# EAGLE schematic Shield_Semaforo (EAGLE 9.5.1)
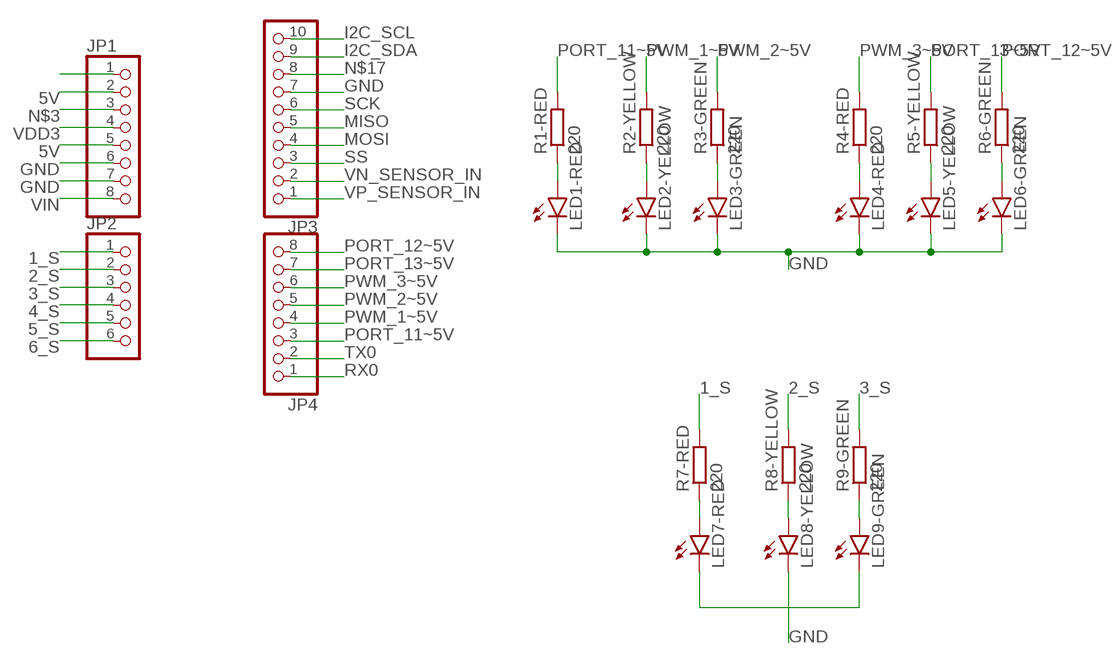
[diagram p0: schematic, sheet 1]

## Parts
JP1  PINHD-1X8_2.54-SMD  [1X08SMD]
JP2  PINHD-1X6_2.54-SMD  [1X06SMD]
JP3  PINHD-1X10_2.54-SMD  [1X10SMD]
JP4  PINHD-1X8_2.54-SMD  [1X08SMD]
LED1-RED  LED5MM  [LED5MM]
LED2-YELLOW  LED5MM  [LED5MM]
LED3-GREEN  LED5MM  [LED5MM]
LED4-RED  LED5MM  [LED5MM]
LED5-YELLOW  LED5MM  [LED5MM]
LED6-GREEN  LED5MM  [LED5MM]
LED7-RED  LED5MM  [LED5MM]
LED8-YELLOW  LED5MM  [LED5MM]
LED9-GREEN  LED5MM  [LED5MM]
R1-RED  220  R-EU_M0805  [M0805]
R2-YELLOW  220  R-EU_M0805  [M0805]
R3-GREEN  220  R-EU_M0805  [M0805]
R4-RED  220  R-EU_M0805  [M0805]
R5-YELLOW  220  R-EU_M0805  [M0805]
R6-GREEN  220  R-EU_M0805  [M0805]
R7-RED  220  R-EU_M0805  [M0805]
R8-YELLOW  220  R-EU_M0805  [M0805]
R9-GREEN  220  R-EU_M0805  [M0805]

## Nets
1_S: JP2.1 R7-RED.2
2_S: JP2.2 R8-YELLOW.2
3_S: JP2.3 R9-GREEN.2
4_S: JP2.4
5_S: JP2.5
5V: JP1.2 JP1.5
6_S: JP2.6
GND: JP1.6 JP1.7 JP3.7 LED1-RED.K(C) LED2-YELLOW.K(C) LED3-GREEN.K(C) LED4-RED.K(C) LED5-YELLOW.K(C) LED6-GREEN.K(C) LED8-YELLOW.K(C)
I2C_SCL: JP3.10
I2C_SDA: JP3.9
MISO: JP3.5
MOSI: JP3.4
N$1: JP1.1
N$2: LED1-RED.A R1-RED.1
N$3: JP1.3
N$4: LED2-YELLOW.A R2-YELLOW.1
N$5: LED3-GREEN.A R3-GREEN.1
N$6: LED4-RED.A R4-RED.1
N$7: LED5-YELLOW.A R5-YELLOW.1
N$8: LED6-GREEN.A R6-GREEN.1
N$16: LED7-RED.A R7-RED.1
N$17: JP3.8
N$18: LED8-YELLOW.A R8-YELLOW.1
N$19: LED9-GREEN.A R9-GREEN.1
N$23: LED7-RED.K(C) LED9-GREEN.K(C)
PORT_11~5V: JP4.3 R1-RED.2
PORT_12~5V: JP4.8 R6-GREEN.2
PORT_13~5V: JP4.7 R5-YELLOW.2
PWM_1~5V: JP4.4 R2-YELLOW.2
PWM_2~5V: JP4.5 R3-GREEN.2
PWM_3~5V: JP4.6 R4-RED.2
RX0: JP4.1
SCK: JP3.6
SS: JP3.3
TX0: JP4.2
VDD3: JP1.4
VIN: JP1.8
VN_SENSOR_IN: JP3.2
VP_SENSOR_IN: JP3.1

## Library data of the parts
JP1 JP4 = pinhead-1:PINHD-1X8: PIN HEADER
JP2 = pinhead-1:PINHD-1X6: PIN HEADER
JP3 = pinhead-1:PINHD-1X10: PIN HEADER
LED1-RED LED2-YELLOW LED3-GREEN LED4-RED LED5-YELLOW LED6-GREEN LED7-RED LED8-YELLOW LED9-GREEN = led:LED: LED OSRAM: - CHIPLED LG R971, LG N971, LY N971, LG Q971, LY Q971, LO R971, LY R971 LH N974, LH R974 LS Q976, LO Q976, LY Q976 LO Q996 - Hyper CHIPLED LW Q18S LB Q993, LB Q99A, LB R99A - SideLED LS A670, LO A670, LY A670, LG A670, LP A670 LB A673, LV A673, LT A673, LW A673 LH A674 LY A675 LS A676, LA A676, LO A676, LY A676, LW A676 LS A679, LY A679, LG A679 - Hyper Micro SIDELED® LS Y876, LA Y876, LO Y876, LY Y876 LT Y87S - SmartLED LW L88C, LW L88S LB L89C, LB L89S, LG L890 LS L89K, LO L89K, LY L89K LS L896, LA L896, LO L896, LY L896 - TOPLED LS T670, LO T670, LY T670, LG T670, LP T670 LSG T670, LSP T670, LSY T670, LOP T670, LYG T670 LG T671, LOG T671, LSG T671 LB T673, LV T673, LT T673, LW T673 LH T674 LS T676, LA T676, LO T676, LY T676, LB T676, LH T676, LSB T676, LW T676 LB T67C, LV T67C, LT T67C, LS T67K, LO T67K, LY T67K, LW E67C LS E67B, LA E67B, LO E67B, LY E67B, LB E67C, LV E67C, LT E67C LW T67C LS T679, LY T679, LG T679 LS T770, LO T770, LY T770, LG T770, LP T770 LB T773, LV T773, LT T773, LW T773 LH T774 LS E675, LA E675, LY E675, LS T675 LS T776, LA T776, LO T776, LY T776, LB T776 LHGB T686 LT T68C, LB T68C - Hyper Mini TOPLED® LB M676 - Mini TOPLED Santana® LG M470 LS M47K, LO M47K, LY M47K Source: http://www.osram.convergy.de LUXEON: - LUMILED® LXK2-PW12-R00, LXK2-PW12-S00, LXK2-PW14-U00, LXK2-PW14-V00 LXK2-PM12-R00, LXK2-PM12-S00, LXK2-PM14-U00 LXK2-PE12-Q00, LXK2-PE12-R00, LXK2-PE12-S00, LXK2-PE14-T00, LXK2-PE14-U00 LXK2-PB12-K00, LXK2-PB12-L00, LXK2-PB12-M00, LXK2-PB14-N00, LXK2-PB14-P00, LXK2-PB14-Q00 LXK2-PR12-L00, LXK2-PR12-M00, LXK2-PR14-Q00, LXK2-PR14-R00 LXK2-PD12-Q00, LXK2-PD12-R00, LXK2-PD12-S00 LXK2-PH12-R00, LXK2-PH12-S00 LXK2-PL12-P00, LXK2-PL12-Q00, LXK2-PL12-R00 Source: www.luxeon.com KINGBRIGHT: KA-3528ASYC Source: www.kingbright.com
R1-RED R2-YELLOW R3-GREEN R4-RED R5-YELLOW R6-GREEN R7-RED R8-YELLOW R9-GREEN = rcl:R-EU_: RESISTOR, European symbol; SPICEPREFIX: R